# Altium project dtu.PrjPcb
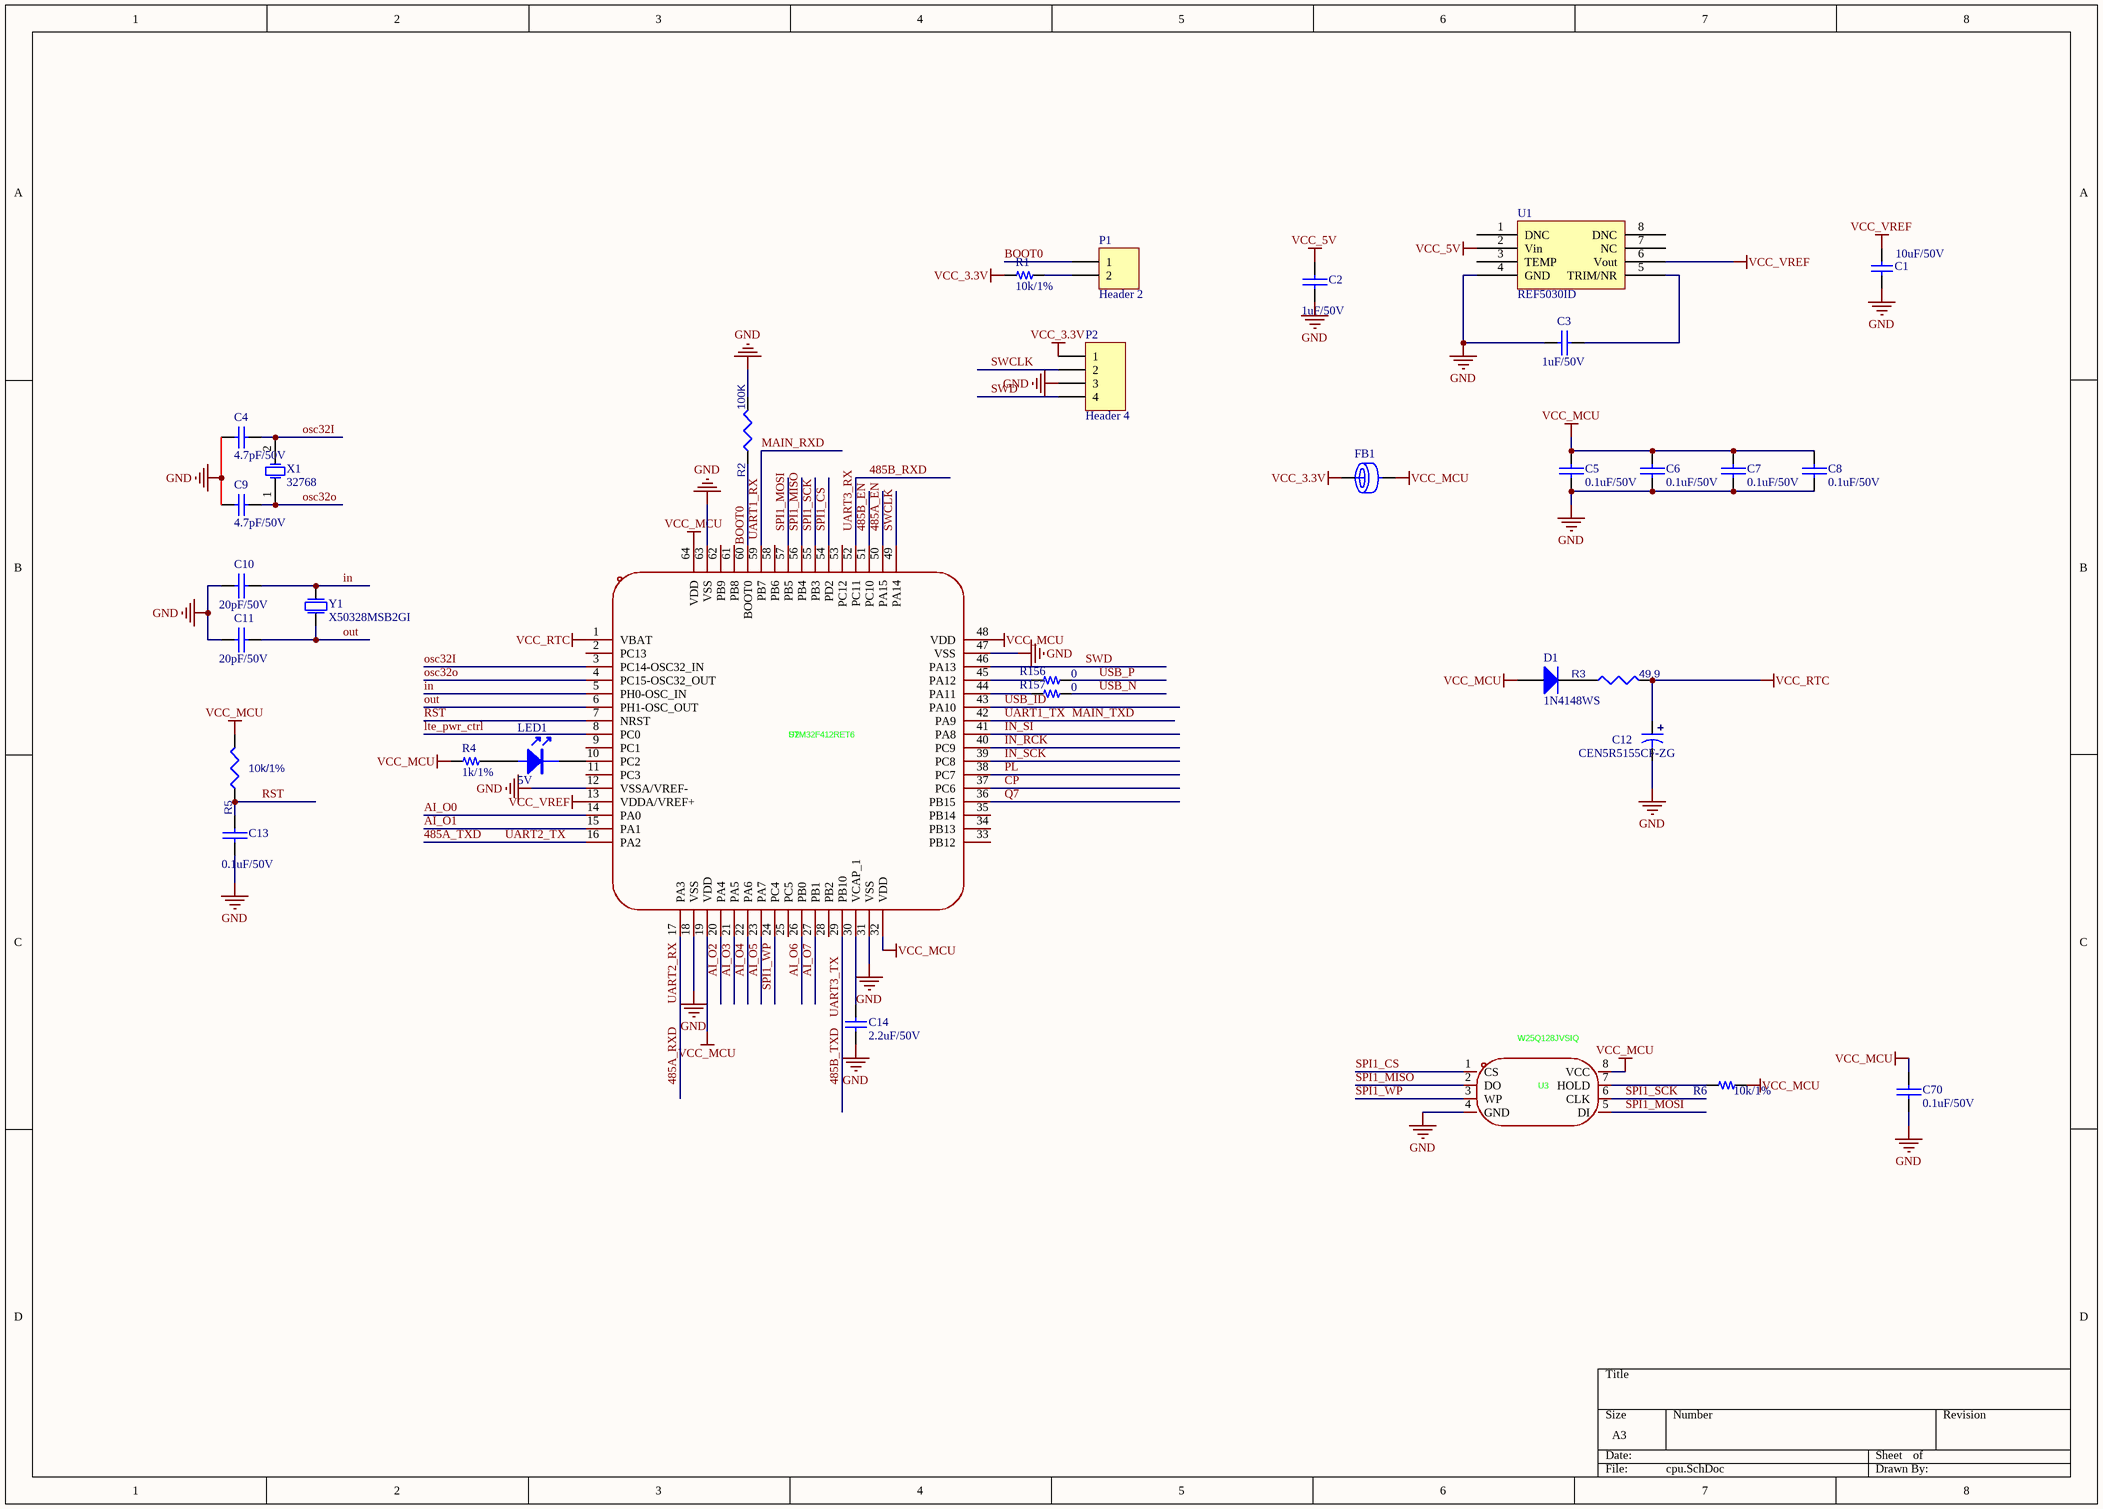
[diagram p0: cpu.SchDoc]
4 sheets, 186 parts. Net scope: global (net labels, ports and power ports of the same name join across sheets).
Board file: DTU_V1.0.PcbDoc
Sheets:
  cpu.SchDoc
  DI.SchDoc
  lte.SchDoc
  power.SchDoc

## Sheet cpu.SchDoc
size A3; SheetNumber: 1; SheetTotal: 7

### Parts
C1  10uF/50V  [CAPC2012X127N_0805]
C2  1uF/50V  [CAPC1608X092N_0603]
C3  1uF/50V  [CAPC1608X092N_0603]
C4  4.7pF/50V  [0603C]
C5  0.1uF/50V  [CAPC1608X092N_0603]
C6  0.1uF/50V  [CAPC1608X092N_0603]
C7  0.1uF/50V  [CAPC1608X092N_0603]
C8  0.1uF/50V  [CAPC1608X092N_0603]
C9  4.7pF/50V  [0603C]
C10  value 20pF/50V  [CAPC1608X092N_0603]  (hidden comment: 20pF/25V)
C11  value 20pF/50V  [CAPC1608X092N_0603]  (hidden comment: 20pF/25V)
C12  CEN5R5155CF-ZG  [CAP-TH_BD21.0-P5.00-D0.8_CENXXX-CF]
C13  0.1uF/50V  [CAPC1608X092N_0603]
C14  2.2uF/50V  [0603C]
C70  0.1uF/50V  [CAPC1608X092N_0603]
D1  1N4148WS  [SOD323]
FB1  FBC0603  [FBC0603]  (value not drawn)
LED1  5V  [0603LED]
P1  Header 2  [HDR1X2]
P2  Header 4  [HDR1X4]
R1  10k/1%  [RESC1608X055N_0603]
R2  100K  [0603R]
R3  49.9  [0603R]
R4  1k/1%  [RESC1608X055N_0603]
R5  10k/1%  [0603R]
R6  10k/1%  [RESC1608X055N_0603]
R156  0  [RESC1608X055N_0603]  (no BOM)
R157  0  [RESC1608X055N_0603]  (no BOM)
U1  REF5030ID  [SO-8]
U2  STM32F412RET6  [LQFP-64]
U3  W25Q128JVSIQ  [so-8]
X1  32768  [A]
Y1  X50328MSB2GI  [CRAY_5032]

### Nets
GND: C1.1 C2.1 C3.2 C4.2 C5.1 C6.1 C7.1 C8.1 C9.2 C10.2 C11.2 C12.2 C13.1 C14.2 C70.1 P2.3 R2.2 U1.4(GND) U2.12(VSSA/VREF-) U2.18(VSS) U2.31(VSS) U2.47(VSS) U2.63(VSS) U3.4(GND)
VCC_3.3V: FB1.1 P2.1 R1.1
VCC_5V: C2.2 U1.2(Vin)
VCC_MCU: C5.2 C6.2 C7.2 C8.2 C70.2 D1.1(A) FB1.2 R4.2 R5.2 R6.1 U2.19(VDD) U2.32(VDD) U2.48(VDD) U2.64(VDD) U3.8(VCC)
VCC_RTC: C12.1 R3.2 U2.1(VBAT)
VCC_VREF: C1.2 U1.6(Vout) U2.13(VDDA/VREF+)
485A_EN: U2.50(PA15)
485A_RXD: U2.17(PA3)  [also labelled UART2_RX]
485A_TXD: U2.16(PA2)  [also labelled UART2_TX]
485B_EN: U2.51(PC10)
485B_RXD: U2.52(PC11)  [also labelled UART3_RX]
485B_TXD: U2.29(PB10)  [also labelled UART3_TX]
AI_O0: U2.14(PA0)
AI_O1: U2.15(PA1)
AI_O2: U2.20(PA4)
AI_O3: U2.21(PA5)
AI_O4: U2.22(PA6)
AI_O5: U2.23(PA7)
AI_O6: U2.26(PB0)
AI_O7: U2.27(PB1)
BOOT0: P1.1 R2.1 U2.60(BOOT0)
CP: U2.37(PC6)
in: C10.1 U2.5(PH0-OSC_IN) Y1.1(P1)
IN_RCK: U2.40(PC9)
IN_SCK: U2.39(PC8)
IN_SI: U2.41(PA8)
lte_pwr_ctrl: U2.8(PC0)
MAIN_RXD: U2.59(PB7)  [also labelled UART1_RX]
MAIN_TXD: U2.42(PA9)  [also labelled UART1_TX]
osc32I: C4.1 U2.3(PC14-OSC32_IN) X1.2(OSC2)
osc32o: C9.1 U2.4(PC15-OSC32_OUT) X1.1(OSC1)
out: C11.1 U2.6(PH1-OSC_OUT) Y1.2(P2)
PL: U2.38(PC7)
Q7: U2.36(PB15)
RST: C13.2 R5.1 U2.7(NRST)
SPI1_CS: U2.54(PD2) U3.1(CS)
SPI1_MISO: U2.56(PB4) U3.2(DO)
SPI1_MOSI: U2.57(PB5) U3.5(DI)
SPI1_SCK: U2.55(PB3) U3.6(CLK)
SPI1_WP: U2.24(PC4) U3.3(WP)
SWCLK: P2.2 U2.49(PA14)
SWD: P2.4 U2.46(PA13)
USB_ID: U2.43(PA10)
USB_N: R157.1
USB_P: R156.1
NetC3_1: C3.1 U1.5(TRIM/NR)
NetC14_1: C14.1 U2.30(VCAP_1)
NetD1_2: D1.2(K) R3.1
NetLED1_1: LED1.1 R4.1
NetLED1_2: LED1.2 U2.10(PC2)
NetP1_2: P1.2 R1.2
NetR6_2: R6.2 U3.7(HOLD)
NetR156_2: R156.2 U2.45(PA12)
NetR157_2: R157.2 U2.44(PA11)

Not connected (* = marked no-connect by the designer): U1 1(DNC) 3(TEMP) 7(NC) 8(DNC); U2 2(PC13) 9(PC1) 11(PC3) 25(PC5) 28(PB2) 33(PB12) 34(PB13) 35(PB14) 53(PC12) 58(PB6) 61(PB8) 62(PB9)

### Library data of the parts
C1 = Cap: PartNumber: CL21A106KBYQNNE; Value: 10uF/50V; Package: 0805
C2 C3 C13 = CAP: PartNumber: CL10A105KB8NNNC; Package: 0603
  C2 C3: Value: 1uF/50V
  C13: Value: 0.1uF/50V
C4 = Cap: Capacitor; Value: 4.7pF
C5-C8 C70 = CAP: PartNumber: CC0603KRX7R9BB104; Value: 0.1uF/50V; Package: 0603
C9 C14 = Cap: Capacitor
  C14: Value: 2.2uF/50V
C10 C11 = CAP: PartNumber: CC0603JRNPO9BN200; Package: 0603
C12 = CAP2: 电解电容
D1 = DIODE
FB1 = FBC0603: PartNumber: BLM18AG601SN1D; Value: 600 Ohms @ 100MHz
LED1 = LED: Package: 0603
P1 = Header 2: Header, 2-Pin
P2 = Header 4: Header, 4-Pin
R1 R4 R6 R156 R157 = R: PartNumber: RC0603FR-071KL; Package: 0603
  R1 R6: Value: 10k/1%
  R4: Value: 1k/1%
  R156 R157: Value: 0
R2 R3 = RESISTOR_0
  R2: Value: 100K
  R3: Value: 49.9
R5 = RESISTOR_0: Value: 10K
U1 = REF5030: PartNumber: REF5030IDR; Value: REF5030ID
U3 = XL1509-5.0
X1 = XTAL: Crystal Oscillator
Y1 = XTAL: Value: X50328MSB2GI; PartNumber: X50328MSB2GI

## Sheet DI.SchDoc
size A2; SheetNumber: 4; SheetTotal: 7
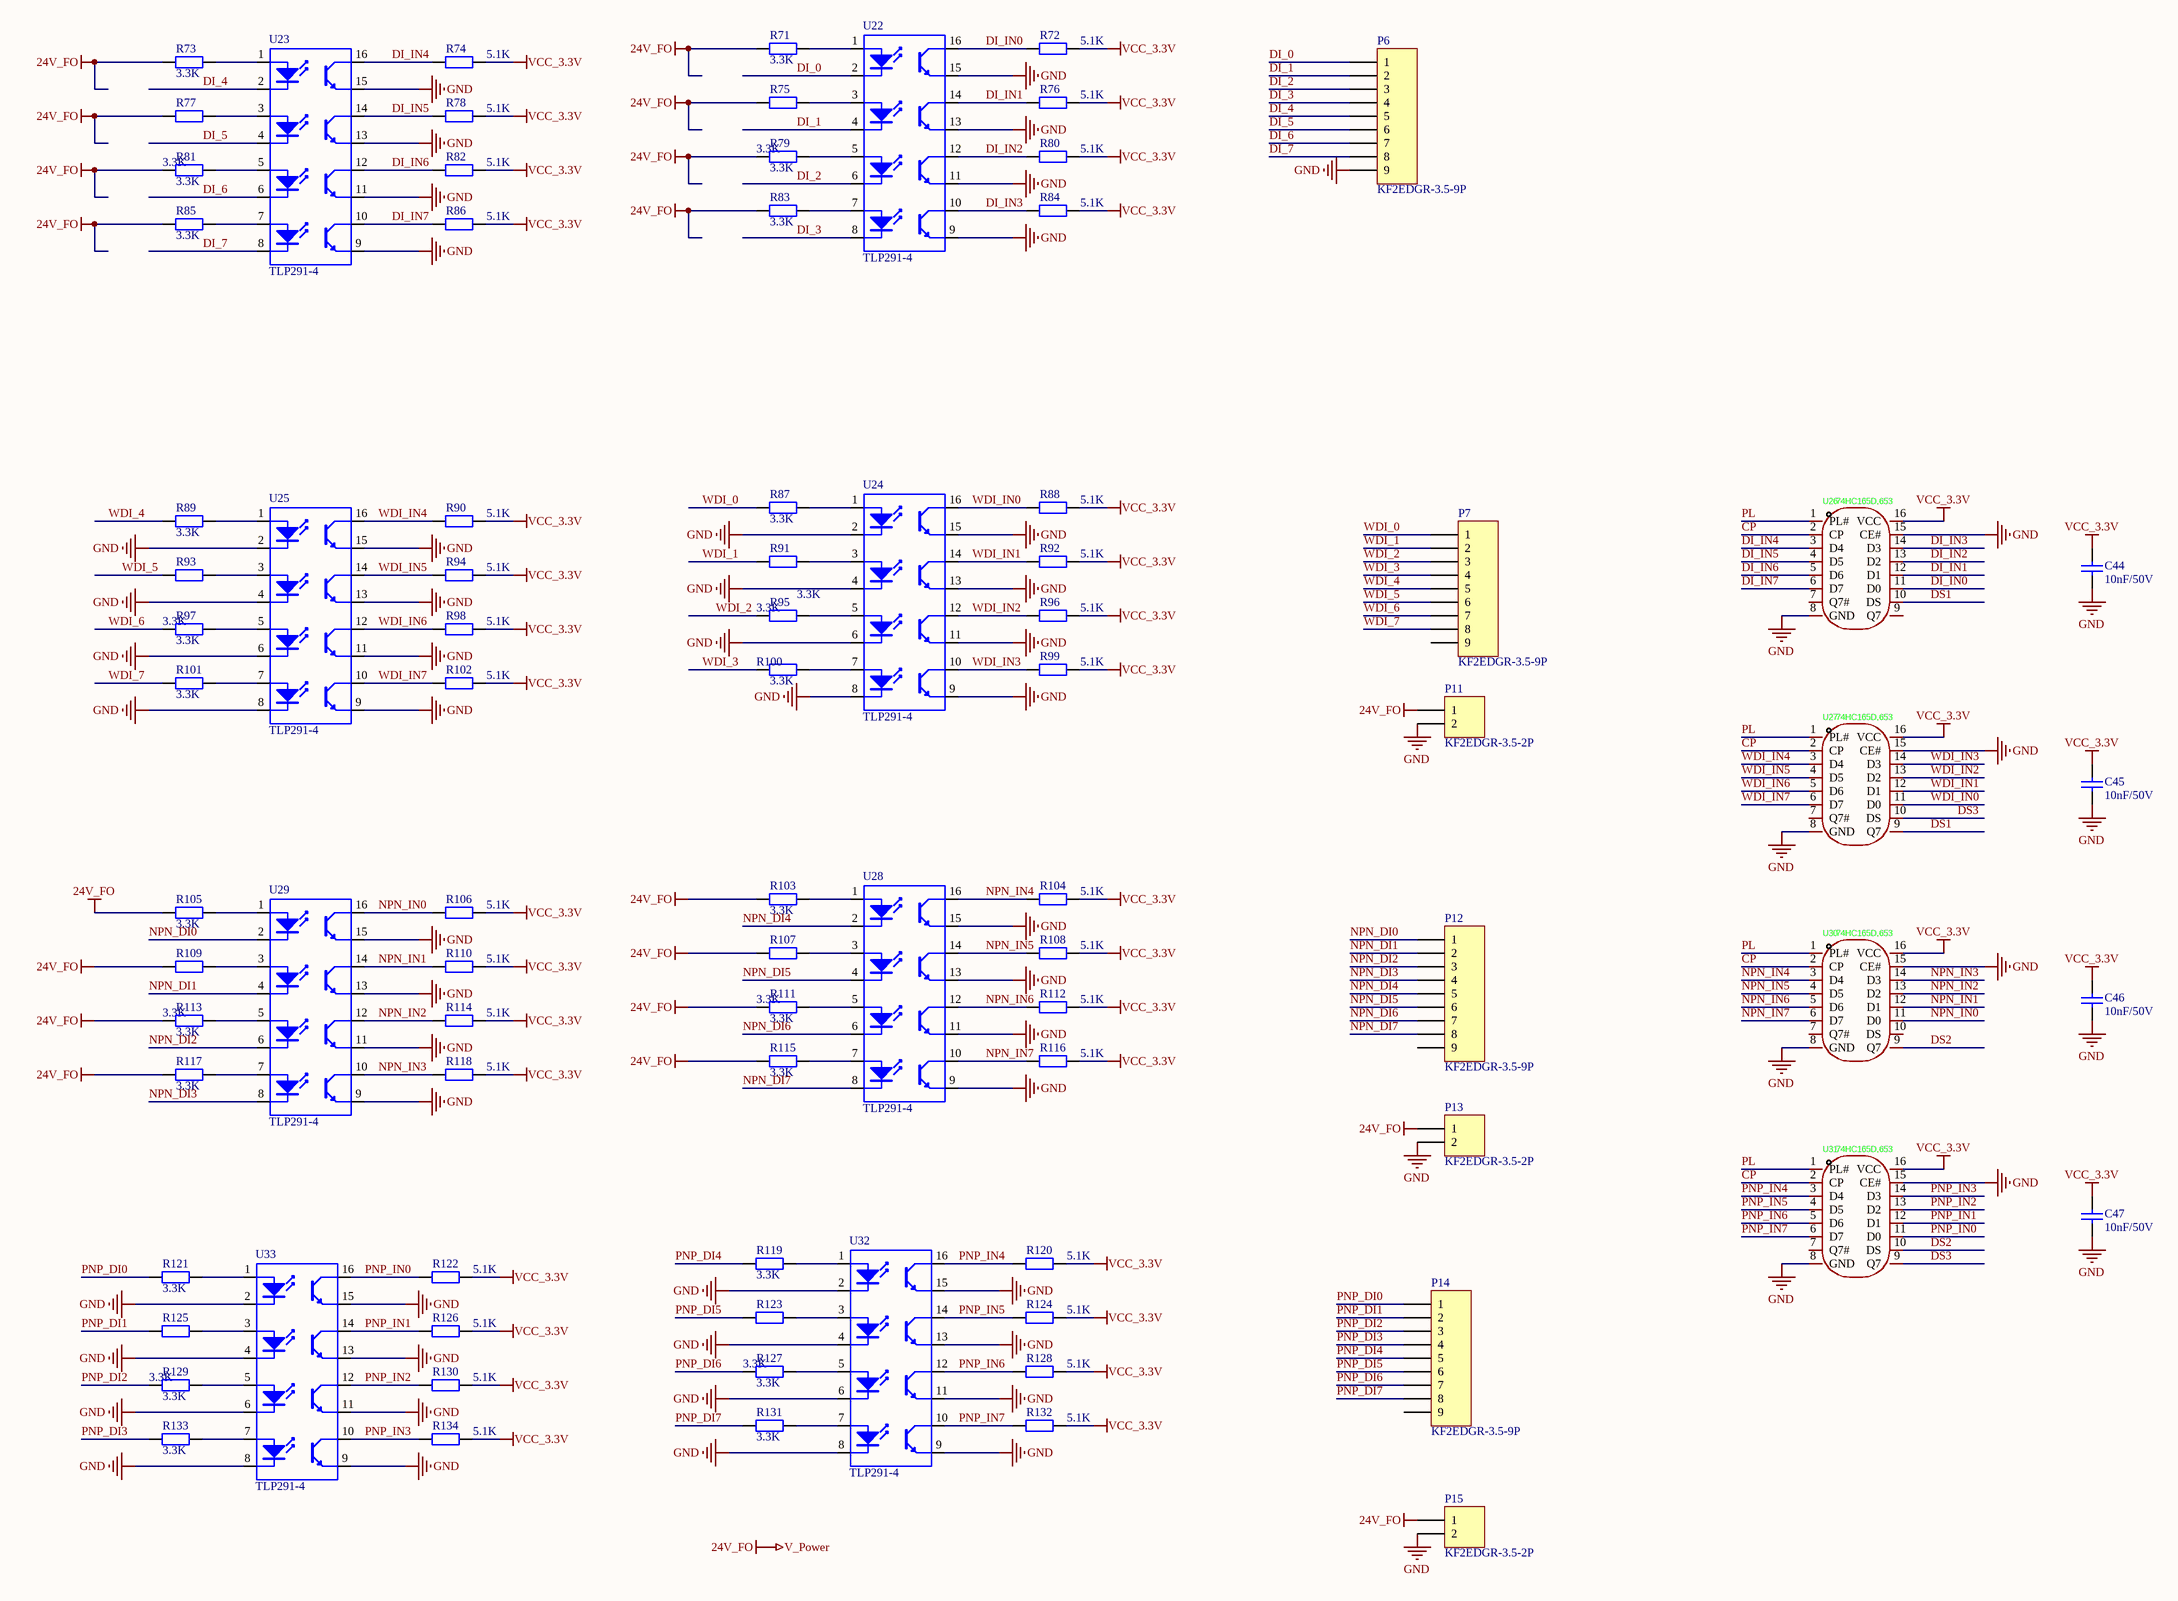
[diagram p1: DI.SchDoc]

### Parts
C44  10nF/50V  [0603C]
C45  10nF/50V  [0603C]
C46  10nF/50V  [0603C]
C47  10nF/50V  [0603C]
P6  KF2EDGR-3.5-9P  [CONN-TH_9P-P3.50_KF2EDGR-3.5-9P]
P7  KF2EDGR-3.5-9P  [CONN-TH_9P-P3.50_KF2EDGR-3.5-9P]
P11  KF2EDGR-3.5-2P  [CONN-TH_P3.50_KF2EDGR-3.5-2P]
P12  KF2EDGR-3.5-9P  [CONN-TH_9P-P3.50_KF2EDGR-3.5-9P]
P13  KF2EDGR-3.5-2P  [CONN-TH_P3.50_KF2EDGR-3.5-2P]
P14  KF2EDGR-3.5-9P  [CONN-TH_9P-P3.50_KF2EDGR-3.5-9P]
P15  KF2EDGR-3.5-2P  [CONN-TH_P3.50_KF2EDGR-3.5-2P]
R71  3.3K  [0603R]
R72  5.1K  [0603R]
R73  3.3K  [0603R]
R74  5.1K  [0603R]
R75  3.3K  [0603R]
R76  5.1K  [0603R]
R77  3.3K  [0603R]
R78  5.1K  [0603R]
R79  3.3K  [0603R]
R80  5.1K  [0603R]
R81  3.3K  [0603R]
R82  5.1K  [0603R]
R83  3.3K  [0603R]
R84  5.1K  [0603R]
R85  3.3K  [0603R]
R86  5.1K  [0603R]
R87  3.3K  [0603R]
R88  5.1K  [0603R]
R89  3.3K  [0603R]
R90  5.1K  [0603R]
R91  3.3K  [0603R]
R92  5.1K  [0603R]
R93  3.3K  [0603R]
R94  5.1K  [0603R]
R95  3.3K  [0603R]
R96  5.1K  [0603R]
R97  3.3K  [0603R]
R98  5.1K  [0603R]
R99  5.1K  [0603R]
R100  3.3K  [0603R]
R101  3.3K  [0603R]
R102  5.1K  [0603R]
R103  3.3K  [0603R]
R104  5.1K  [0603R]
R105  3.3K  [0603R]
R106  5.1K  [0603R]
R107  3.3K  [0603R]
R108  5.1K  [0603R]
R109  3.3K  [0603R]
R110  5.1K  [0603R]
R111  3.3K  [0603R]
R112  5.1K  [0603R]
R113  3.3K  [0603R]
R114  5.1K  [0603R]
R115  3.3K  [0603R]
R116  5.1K  [0603R]
R117  3.3K  [0603R]
R118  5.1K  [0603R]
R119  3.3K  [0603R]
R120  5.1K  [0603R]
R121  3.3K  [0603R]
R122  5.1K  [0603R]
R123  3.3K  [0603R]
R124  5.1K  [0603R]
R125  3.3K  [0603R]
R126  5.1K  [0603R]
R127  3.3K  [0603R]
R128  5.1K  [0603R]
R129  3.3K  [0603R]
R130  5.1K  [0603R]
R131  3.3K  [0603R]
R132  5.1K  [0603R]
R133  3.3K  [0603R]
R134  5.1K  [0603R]
U22  TLP291-4  [SOP16-T]
U23  TLP291-4  [SOP16-T]
U24  TLP291-4  [SOP16-T]
U25  TLP291-4  [SOP16-T]
U26  74HC165D,653  [SOP-16_L10.0-W3.9-P1.27-LS6.0-BL]
U27  74HC165D,653  [SOP-16_L10.0-W3.9-P1.27-LS6.0-BL]
U28  TLP291-4  [SOP16-T]
U29  TLP291-4  [SOP16-T]
U30  74HC165D,653  [SOP-16_L10.0-W3.9-P1.27-LS6.0-BL]
U31  74HC165D,653  [SOP-16_L10.0-W3.9-P1.27-LS6.0-BL]
U32  TLP291-4  [SOP16-T]
U33  TLP291-4  [SOP16-T]

### Nets
24V_FO: P11.1 P13.1 P15.1 R71.2 R73.2 R75.2 R77.2 R79.2 R81.2 R83.2 R85.2 R103.2 R105.2 R107.2 R109.2 R111.2 R113.2 R115.2 R117.2  [also labelled V_Power]
GND: C44.1 C45.1 C46.1 C47.1 P6.9 P11.2 P13.2 P15.2 U22.9(E) U22.11(E) U22.13(E) U22.15(E) U23.9(E) U23.11(E) U23.13(E) U23.15(E) U24.2(K) U24.4(K) U24.6(K) U24.8(K) U24.9(E) U24.11(E) U24.13(E) U24.15(E) U25.2(K) U25.4(K) U25.6(K) U25.8(K) U25.9(E) U25.11(E) U25.13(E) U25.15(E) U26.8(GND) U26.15(CE#) U27.8(GND) U27.15(CE#) U28.9(E) U28.11(E) U28.13(E) U28.15(E) U29.9(E) U29.11(E) U29.13(E) U29.15(E) U30.8(GND) U30.15(CE#) U31.8(GND) U31.15(CE#) U32.2(K) U32.4(K) U32.6(K) U32.8(K) U32.9(E) U32.11(E) U32.13(E) U32.15(E) U33.2(K) U33.4(K) U33.6(K) U33.8(K) U33.9(E) U33.11(E) U33.13(E) U33.15(E)
VCC_3.3V: C44.2 C45.2 C46.2 C47.2 R72.1 R74.1 R76.1 R78.1 R80.1 R82.1 R84.1 R86.1 R88.1 R90.1 R92.1 R94.1 R96.1 R98.1 R99.1 R102.1 R104.1 R106.1 R108.1 R110.1 R112.1 R114.1 R116.1 R118.1 R120.1 R122.1 R124.1 R126.1 R128.1 R130.1 R132.1 R134.1 U26.16(VCC) U27.16(VCC) U30.16(VCC) U31.16(VCC)
CP: U26.2(CP) U27.2(CP) U30.2(CP) U31.2(CP)
DI_0: P6.1 U22.2(K)
DI_1: P6.2 U22.4(K)
DI_2: P6.3 U22.6(K)
DI_3: P6.4 U22.8(K)
DI_4: P6.5 U23.2(K)
DI_5: P6.6 U23.4(K)
DI_6: P6.7 U23.6(K)
DI_7: P6.8 U23.8(K)
DI_IN0: R72.2 U22.16(C) U26.11(D0)
DI_IN1: R76.2 U22.14(C) U26.12(D1)
DI_IN2: R80.2 U22.12(C) U26.13(D2)
DI_IN3: R84.2 U22.10(C) U26.14(D3)
DI_IN4: R74.2 U23.16(C) U26.3(D4)
DI_IN5: R78.2 U23.14(C) U26.4(D5)
DI_IN6: R82.2 U23.12(C) U26.5(D6)
DI_IN7: R86.2 U23.10(C) U26.6(D7)
DS1: U26.10(DS) U27.9(Q7)
DS2: U30.9(Q7) U31.10(DS)
DS3: U27.10(DS) U31.9(Q7)
NPN_DI0: P12.1 U29.2(K)
NPN_DI1: P12.2 U29.4(K)
NPN_DI2: P12.3 U29.6(K)
NPN_DI3: P12.4 U29.8(K)
NPN_DI4: P12.5 U28.2(K)
NPN_DI5: P12.6 U28.4(K)
NPN_DI6: P12.7 U28.6(K)
NPN_DI7: P12.8 U28.8(K)
NPN_IN0: R106.2 U29.16(C) U30.11(D0)
NPN_IN1: R110.2 U29.14(C) U30.12(D1)
NPN_IN2: R114.2 U29.12(C) U30.13(D2)
NPN_IN3: R118.2 U29.10(C) U30.14(D3)
NPN_IN4: R104.2 U28.16(C) U30.3(D4)
NPN_IN5: R108.2 U28.14(C) U30.4(D5)
NPN_IN6: R112.2 U28.12(C) U30.5(D6)
NPN_IN7: R116.2 U28.10(C) U30.6(D7)
PL: U26.1(PL#) U27.1(PL#) U30.1(PL#) U31.1(PL#)
PNP_DI0: P14.1 R121.2
PNP_DI1: P14.2 R125.2
PNP_DI2: P14.3 R129.2
PNP_DI3: P14.4 R133.2
PNP_DI4: P14.5 R119.2
PNP_DI5: P14.6 R123.2
PNP_DI6: P14.7 R127.2
PNP_DI7: P14.8 R131.2
PNP_IN0: R122.2 U31.11(D0) U33.16(C)
PNP_IN1: R126.2 U31.12(D1) U33.14(C)
PNP_IN2: R130.2 U31.13(D2) U33.12(C)
PNP_IN3: R134.2 U31.14(D3) U33.10(C)
PNP_IN4: R120.2 U31.3(D4) U32.16(C)
PNP_IN5: R124.2 U31.4(D5) U32.14(C)
PNP_IN6: R128.2 U31.5(D6) U32.12(C)
PNP_IN7: R132.2 U31.6(D7) U32.10(C)
WDI_0: P7.1 R87.2
WDI_1: P7.2 R91.2
WDI_2: P7.3 R95.2
WDI_3: P7.4 R100.2
WDI_4: P7.5 R89.2
WDI_5: P7.6 R93.2
WDI_6: P7.7 R97.2
WDI_7: P7.8 R101.2
WDI_IN0: R88.2 U24.16(C) U27.11(D0)
WDI_IN1: R92.2 U24.14(C) U27.12(D1)
WDI_IN2: R96.2 U24.12(C) U27.13(D2)
WDI_IN3: R99.2 U24.10(C) U27.14(D3)
WDI_IN4: R90.2 U25.16(C) U27.3(D4)
WDI_IN5: R94.2 U25.14(C) U27.4(D5)
WDI_IN6: R98.2 U25.12(C) U27.5(D6)
WDI_IN7: R102.2 U25.10(C) U27.6(D7)
NetR71_1: R71.1 U22.1(A)
NetR73_1: R73.1 U23.1(A)
NetR75_1: R75.1 U22.3(A)
NetR77_1: R77.1 U23.3(A)
NetR79_1: R79.1 U22.5(A)
NetR81_1: R81.1 U23.5(A)
NetR83_1: R83.1 U22.7(A)
NetR85_1: R85.1 U23.7(A)
NetR87_1: R87.1 U24.1(A)
NetR89_1: R89.1 U25.1(A)
NetR91_1: R91.1 U24.3(A)
NetR93_1: R93.1 U25.3(A)
NetR95_1: R95.1 U24.5(A)
NetR97_1: R97.1 U25.5(A)
NetR100_1: R100.1 U24.7(A)
NetR101_1: R101.1 U25.7(A)
NetR103_1: R103.1 U28.1(A)
NetR105_1: R105.1 U29.1(A)
NetR107_1: R107.1 U28.3(A)
NetR109_1: R109.1 U29.3(A)
NetR111_1: R111.1 U28.5(A)
NetR113_1: R113.1 U29.5(A)
NetR115_1: R115.1 U28.7(A)
NetR117_1: R117.1 U29.7(A)
NetR119_1: R119.1 U32.1(A)
NetR121_1: R121.1 U33.1(A)
NetR123_1: R123.1 U32.3(A)
NetR125_1: R125.1 U33.3(A)
NetR127_1: R127.1 U32.5(A)
NetR129_1: R129.1 U33.5(A)
NetR131_1: R131.1 U32.7(A)
NetR133_1: R133.1 U33.7(A)

Not connected (* = marked no-connect by the designer): P7 9; P12 9; P14 9; U26 7(Q7#) 9(Q7); U27 7(Q7#); U30 7(Q7#) 10(DS); U31 7(Q7#)

### Library data of the parts
C44-C47 = Cap: Capacitor; Value: 10nF/50V
P6 P7 P12 P14 = Header 9: Header, 9-Pin
P11 P13 P15 = Header 2: Header, 2-Pin
R71-R134 = Res0805M
U22-U25 U28 U29 U32 U33 = TLP281-4

## Sheet lte.SchDoc
size A3; SheetNumber: 5; SheetTotal: 7
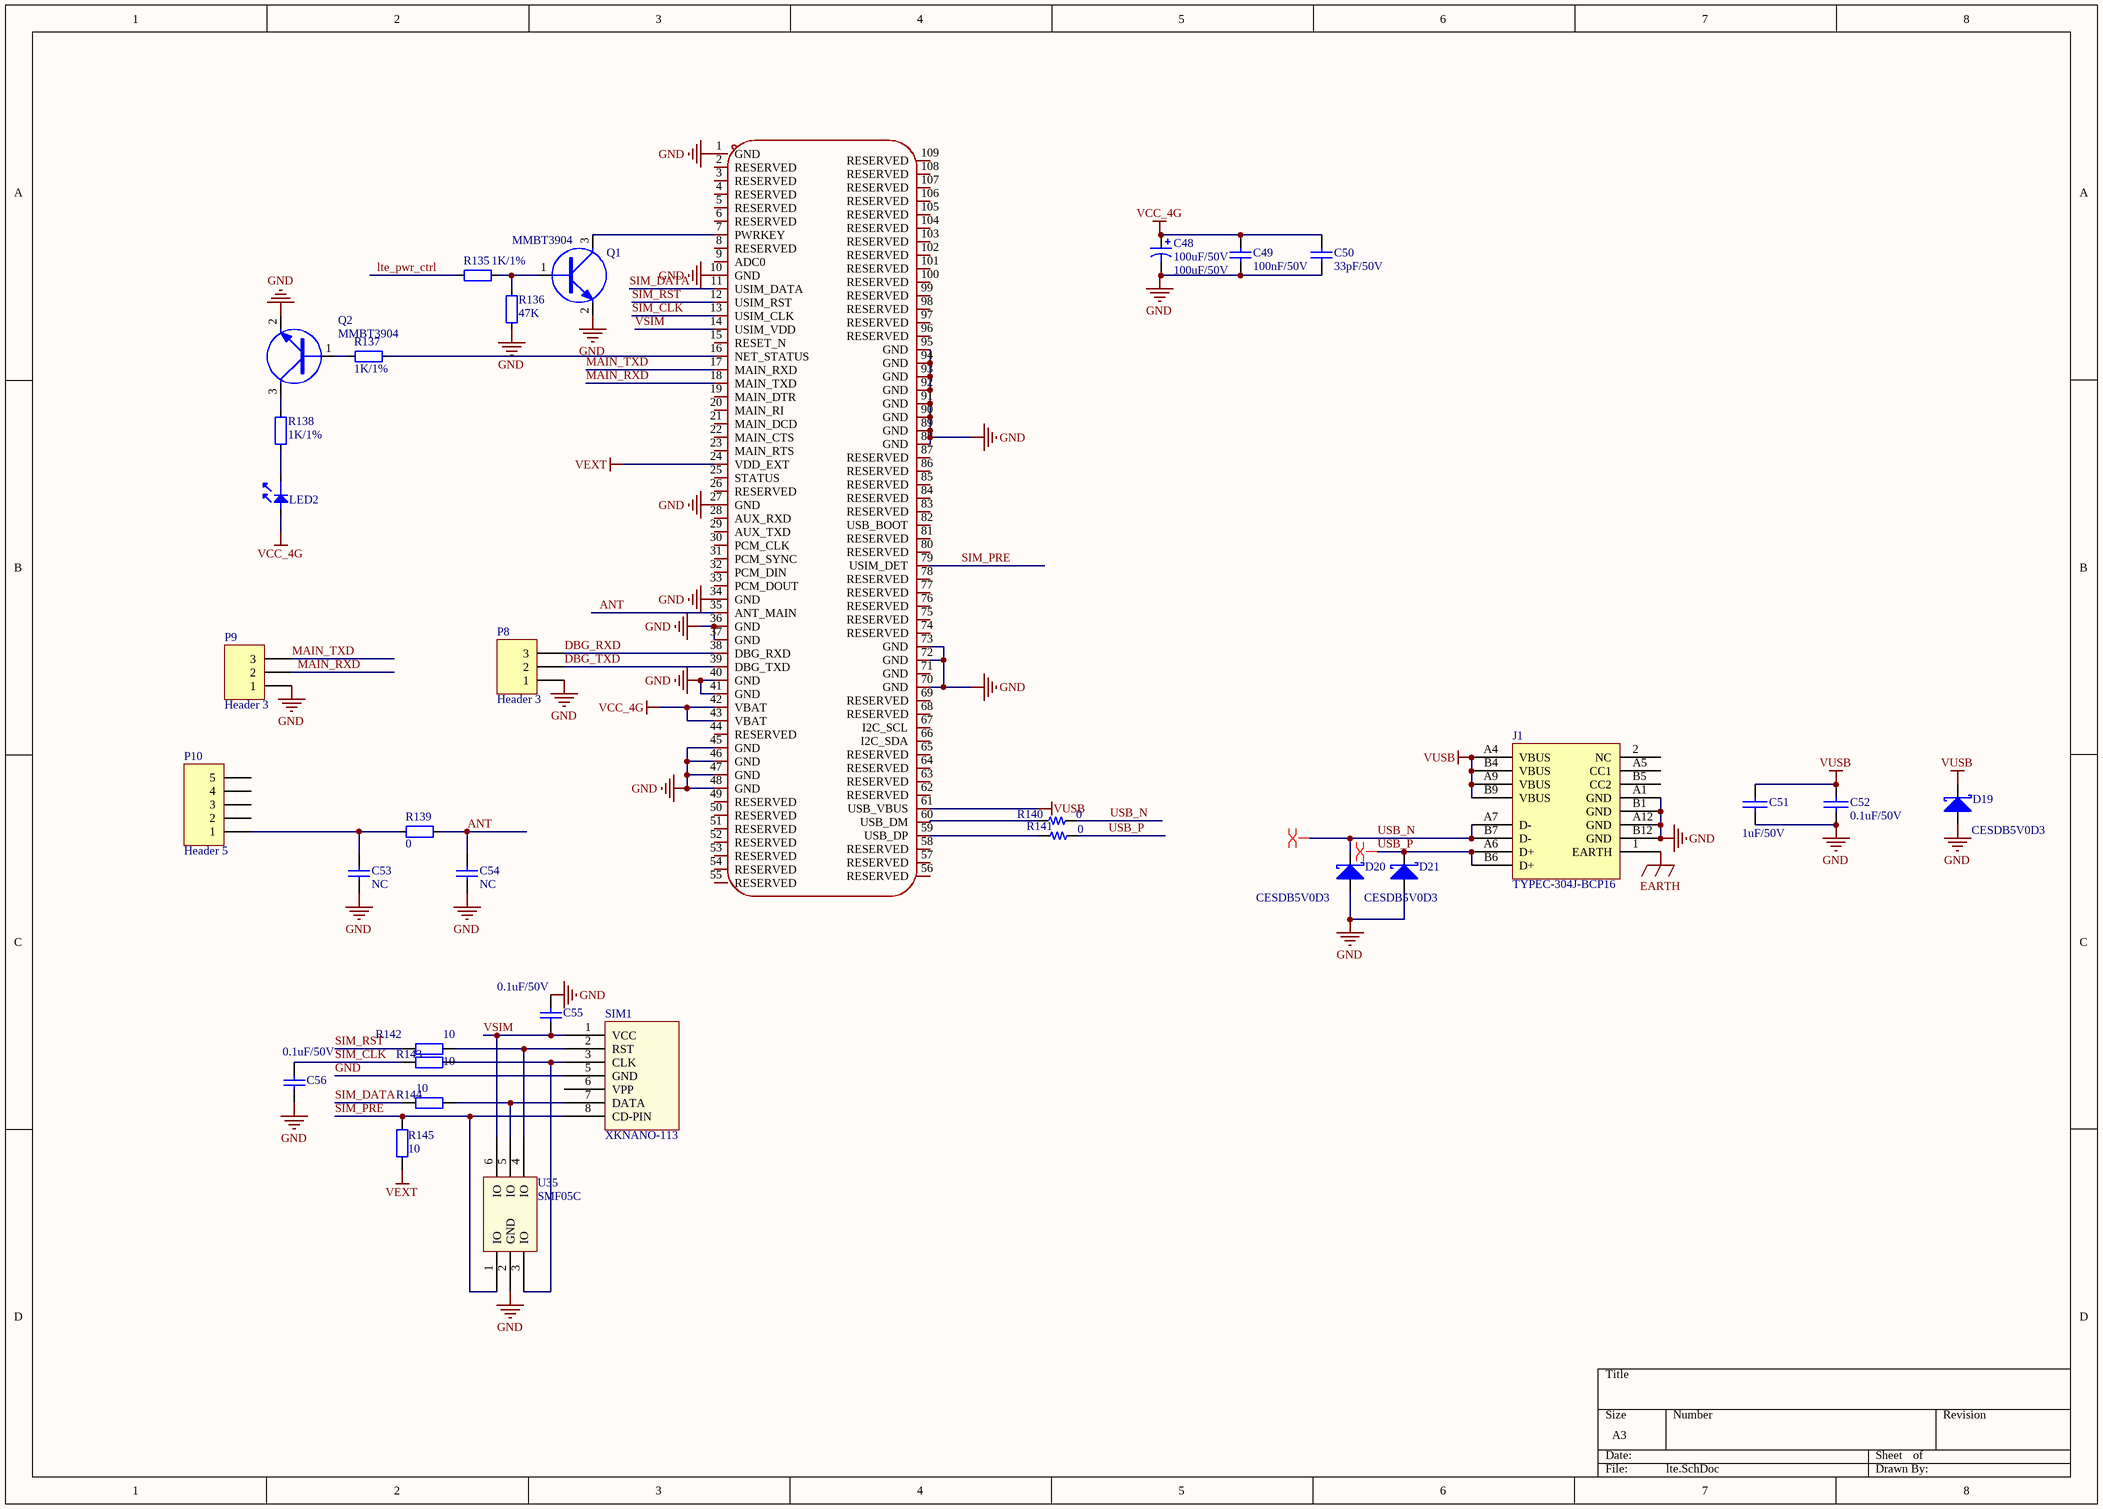
[diagram p2: lte.SchDoc]

### Parts
C48  100uF/50V  [CAP-SMD_BD6.3-L6.5-W6.5-LS7.0-FD]
C49  100nF/50V  [0603C]
C50  33pF/50V  [0603C]
C51  1uF/50V  [CAPC1608X092N_0603]
C52  0.1uF/50V  [CAPC1608X092N_0603]
C53  NC  [0603c]  (no BOM)
C54  NC  [0603c]  (no BOM)
C55  0.1uF/50V  [0603c]
C56  0.1uF/50V  [0603c]  (no BOM)
D19  CESDB5V0D3  [SOD323]
D20  CESDB5V0D3  [SOD323]
D21  CESDB5V0D3  [SOD323]
J1  TYPEC-304J-BCP16  [TYPEC_16P]
LED2  LED_Green_19-217  [0603led]  (value not drawn)
P8  Header 3  [HDR1X3]
P9  Header 3  [HDR1X3]
P10  Header 5  [KH-SMA-KE-Z]
Q1  MMBT3904  [SOT23-3]
Q2  MMBT3904  [SOT23-3]
R135  1K/1%  [0603R]
R136  47K  [0603r]
R137  1K/1%  [0603r]
R138  1K/1%  [0603R]
R139  0  [0603r]
R140  0  [RESC1608X055N_0603]  (no BOM)
R141  0  [RESC1608X055N_0603]  (no BOM)
R142  10  [0603r]
R143  10  [0603r]
R144  10  [0603r]
R145  10  [0603r]
SIM1  XKNANO-113  [Nano SIM]
U34  EC800ECNNQ-N03-SNNSA  [LCC-LGA-109_L17.7-W15.8-P1.10_MC661]  (value not drawn)
U35  SMF05C  [sc70-6l]

### Nets
EARTH: J1.1(EARTH)
GND: C48.2 C49.1 C50.1 C51.1 C52.1 C53.2 C54.2 C55.1 C56.2 D19.1(A) D20.1(A) D21.1(A) J1.A1(GND) J1.A12(GND) J1.B1(GND) J1.B12(GND) P8.1 P9.1 Q1.2(E) Q2.2(E) R136.1 SIM1.5(GND) U34.1(GND) U34.10(GND) U34.27(GND) U34.34(GND) U34.36(GND) U34.37(GND) U34.40(GND) U34.41(GND) U34.45(GND) U34.46(GND) U34.47(GND) U34.48(GND) U34.70(GND) U34.72(GND) U34.73(GND) U34.88(GND) U34.89(GND) U34.90(GND) U34.91(GND) U34.92(GND) U34.93(GND) U34.94(GND) U34.95(GND) U35.2(GND)
VCC_4G: C48.1 C49.2 C50.2 LED2.1 U34.42(VBAT) U34.43(VBAT)
VEXT: R145.2 U34.24(VDD_EXT)
VUSB: C51.2 C52.2 D19.2(K) J1.A4(VBUS) J1.A9(VBUS) J1.B4(VBUS) J1.B9(VBUS) U34.61(USB_VBUS)
ANT: C54.1 R139.1 U34.35(ANT_MAIN)
DBG_RXD: P8.3 U34.38(DBG_RXD)
DBG_TXD: P8.2 U34.39(DBG_TXD)
lte_pwr_ctrl: R135.1
MAIN_RXD: P9.2 U34.18(MAIN_TXD)
MAIN_TXD: P9.3 U34.17(MAIN_RXD)
SIM_CLK: C56.1 R143.2 U34.13(USIM_CLK)
SIM_DATA: R144.2 U34.11(USIM_DATA)
SIM_PRE: R145.1 SIM1.8(CD-PIN) U34.79(USIM_DET) U35.1(IO)
SIM_RST: R142.2 U34.12(USIM_RST)
USB_N: D20.2(K) J1.A7(D-) J1.B7(D-) R140.1
USB_P: D21.2(K) J1.A6(D+) J1.B6(D+) R141.1
VSIM: C55.2 SIM1.1(VCC) U34.14(USIM_VDD) U35.6(IO)
NetC53_1: C53.1 P10.1 R139.2
NetLED2_2: LED2.2 R138.1
NetQ1_1: Q1.1(B) R135.2 R136.2
NetQ1_3: Q1.3(C) U34.7(PWRKEY)
NetQ2_1: Q2.1(B) R137.2
NetQ2_3: Q2.3(C) R138.2
NetR137_1: R137.1 U34.16(NET_STATUS)
NetR140_2: R140.2 U34.60(USB_DM)
NetR141_2: R141.2 U34.59(USB_DP)
NetR142_1: R142.1 SIM1.2(RST) U35.4(IO)
NetR143_1: R143.1 SIM1.3(CLK) U35.3(IO)
NetR144_1: R144.1 SIM1.7(DATA) U35.5(IO)

Not connected (* = marked no-connect by the designer): J1 2(NC) A5(CC1) B5(CC2); P10 2 3 4 5; SIM1 6(VPP); U34 2(RESERVED) 3(RESERVED) 4(RESERVED) 5(RESERVED) 6(RESERVED) 8(RESERVED) 9(ADC0) 15(RESET_N) 19(MAIN_DTR) 20(MAIN_RI) 21(MAIN_DCD) 22(MAIN_CTS) 23(MAIN_RTS) 25(STATUS) 26(RESERVED) 28(AUX_RXD) 29(AUX_TXD) 30(PCM_CLK) 31(PCM_SYNC) 32(PCM_DIN) 33(PCM_DOUT) 44(RESERVED) 49(RESERVED) 50(RESERVED) 51(RESERVED) 52(RESERVED) 53(RESERVED) 54(RESERVED) 55(RESERVED) 56(RESERVED) 57(RESERVED) 58(RESERVED) 62(RESERVED) 63(RESERVED) 64(RESERVED) 65(RESERVED) 66(I2C_SDA) 67(I2C_SCL) 68(RESERVED) 69(RESERVED) 71(GND) 74(RESERVED) 75(RESERVED) 76(RESERVED) 77(RESERVED) 78(RESERVED) 80(RESERVED) 81(RESERVED) 82(USB_BOOT) 83(RESERVED) 84(RESERVED) 85(RESERVED) 86(RESERVED) 87(RESERVED) 96(RESERVED) 97(RESERVED) 98(RESERVED) 99(RESERVED) 100(RESERVED) 101(RESERVED) 102(RESERVED) 103(RESERVED) 104(RESERVED) 105(RESERVED) 106(RESERVED) 107(RESERVED) 108(RESERVED) 109(RESERVED)

### Layout directives
differential pair: USB_N, USB_P

### Library data of the parts
C48 = Cap Pol3: Polarized Capacitor (Surface Mount); Value: 100uF/50V
C49 C50 C53 C54 = Cap: Capacitor
  C49: Value: 100nF/50V
  C50: Value: 33pF/50V
  C53 C54: Value: NC
C51 = CAP: PartNumber: CL10A105KB8NNNC; Value: 1uF/50V; Package: 0603
C52 = CAP: PartNumber: CC0603KRX7R9BB104; Value: 0.1uF/50V; Package: 0603
C55 C56 = Cap: Capacitor; Value: 0.1uF/10V
D19-D21 = DIODE S: PartNumber: CESDB5V0D3
  D21: Value: CESDB5V0D3
J1 = TYPE C_16P: Value: TYPEC-304J-BCP16; PartNumber: TYPEC-304J-BCP16
LED2 = LED_Green_19-217: 物料主编码(PN): 100000032; Value: 19-217/G7C-AN1P2/3T; 序号: 33; 物料名称: 绿色LED; 物料描述: Other,LED,绿色,0603,1.6X0.8X0.4mm,19-217/G7C-AN1P2/3T; 工作温度: –40°C to 85°C; 制造商: Everlight; 器件等级: ——; 物料类型: 特殊二极管; 规格型号(完整型号): 19-217/G7C-AN1P2/3T
P8 P9 = Header 3: Header, 3-Pin
P10 = Header 5: Header, 5-Pin
Q1 Q2 = NPN_MMBT3904
R135-R138 = RES0603: 物料主编码(PN): 150000040; Value: 1K; 序号: 109; 物料名称: 贴片电阻; 精度: ±1%; 规格型号(完整型号): RC1608F103CS/RC0603FR-0710KL; 物料描述: RES,贴片电阻,0603,10k,±1%,1/10W,1.6X0.8X0.45mm,RC1608F103CS/RC0603FR-0710KL; 工作温度: –55°C to 155°C; 制造商: 三星/YAGEO; 器件等级: ——; 物料类型: 表贴电阻; 参数值: 1.00E+04
R139 = RES0603: 物料主编码(PN): 150000040; 序号: 109; 物料名称: 贴片电阻; 精度: ±1%; 规格型号(完整型号): RC1608F103CS/RC0603FR-0710KL; 物料描述: RES,贴片电阻,0603,10k,±1%,1/10W,1.6X0.8X0.45mm,RC1608F103CS/RC0603FR-0710KL; 工作温度: –55°C to 155°C; 制造商: 三星/YAGEO; 器件等级: ——; 物料类型: 表贴电阻; 参数值: 1.00E+04; Value: 0
R140 R141 = R: PartNumber: RC0603FR-071KL; Value: 0; Package: 0603
R142-R145 = Res2: Resistor; Value: 10R
SIM1 = nano sim

## Sheet power.SchDoc
size A4; SheetNumber: 6; SheetTotal: 7
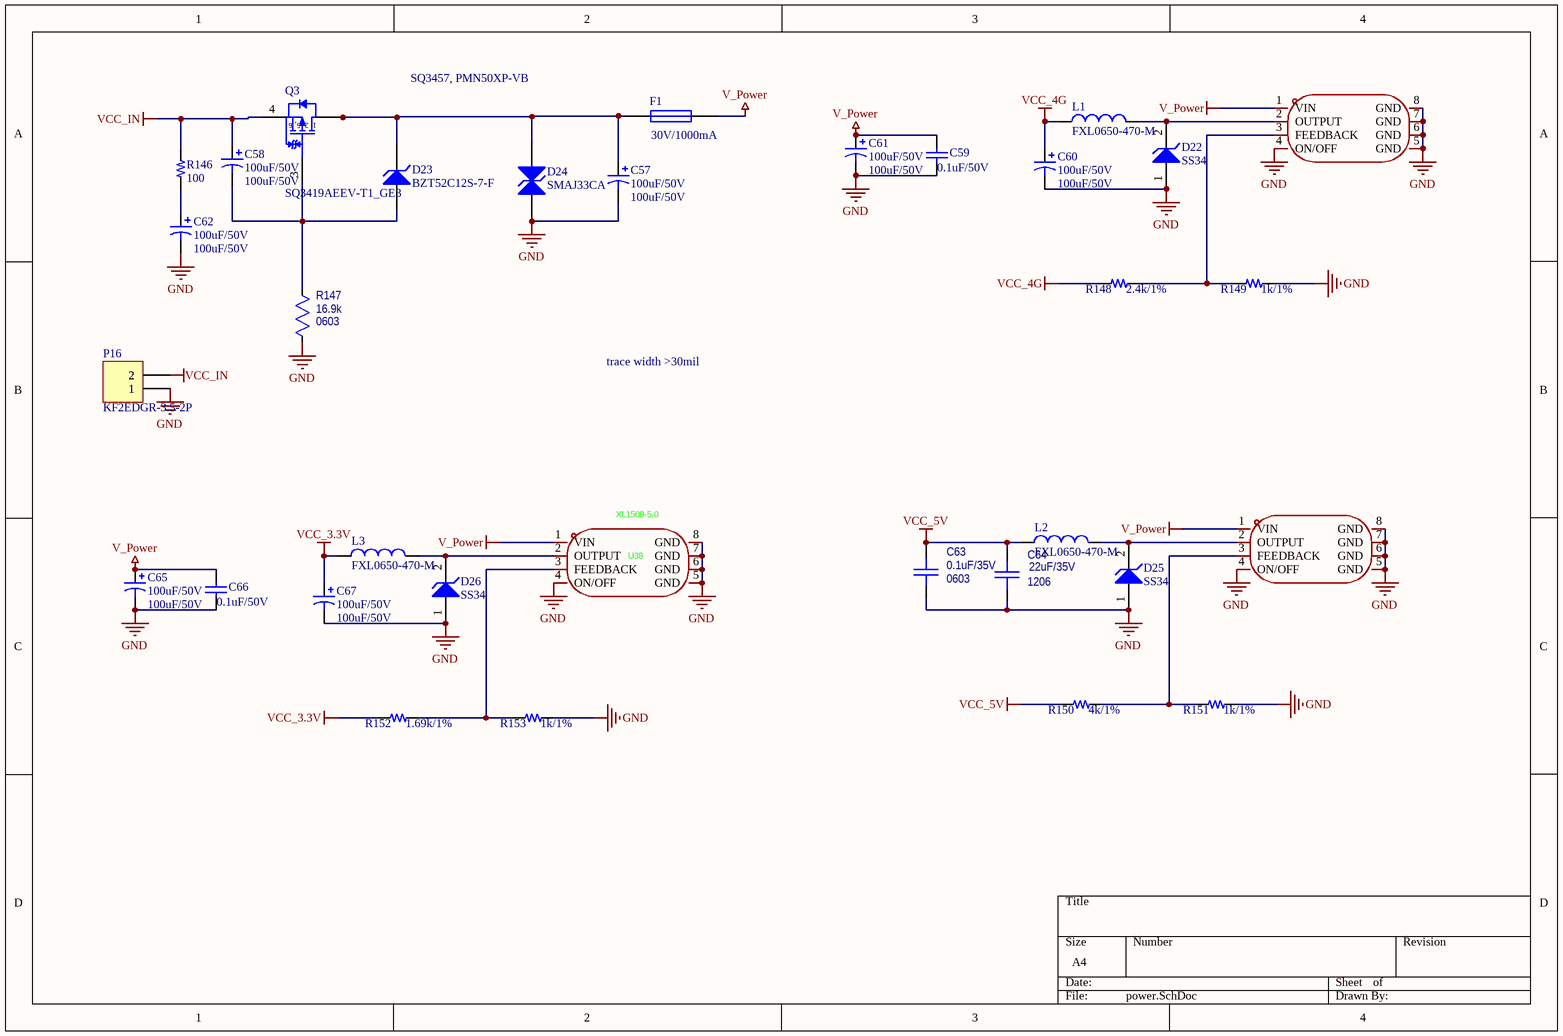
[diagram p3: power.SchDoc]

### Parts
C57  100uF/50V  [CAP-SMD_BD6.3-L6.5-W6.5-LS7.0-FD]
C58  100uF/50V  [CAP-SMD_BD6.3-L6.5-W6.5-LS7.0-FD]
C59  0.1uF/50V  [0603C]
C60  100uF/50V  [CAP-SMD_BD6.3-L6.5-W6.5-LS7.0-FD]
C61  100uF/50V  [CAP-SMD_BD6.3-L6.5-W6.5-LS7.0-FD]
C62  100uF/50V  [CAP-SMD_BD6.3-L6.5-W6.5-LS7.0-FD]
C63  Package: 0603  [CAPC3216X156N_1206]  (hidden comment: 0.1uF/35V)
C64  Package: 1206  [CAPC3216X156N_1206]  (hidden comment: 22uF/35V)
C65  100uF/50V  [CAP-SMD_BD6.3-L6.5-W6.5-LS7.0-FD]
C66  0.1uF/50V  [0603C]
C67  100uF/50V  [CAP-SMD_BD6.3-L6.5-W6.5-LS7.0-FD]
D22  SS34  [SMA]
D23  BZT52C12S-7-F  [DIOD-SOD323-2_V]
D24  SMAJ33CA  [LFUS-DO-214AC-A-2_N]
D25  SS34  [SMA]
D26  SS34  [SMA]
F1  30V/1000mA  [RESC3216X070N_1206]
L1  FXL0650-470-M  [PULS-BDCD00252012_V]
L2  FXL0650-470-M  [PULS-BDCD00252012_V]
L3  FXL0650-470-M  [PULS-BDCD00252012_V]
P16  KF2EDGR-3.5-2P  [CONN-TH_P3.50_KF2EDGR-3.5-2P]
Q3  SQ3419AEEV-T1_GE3  [VISH-TSOP-6_V]
R146  100  [RESC1608X055N_0603]
R147  value 16.9k  Package: 0603  [RESC1608X055N_0603]  (hidden comment: 16.9k/1%)
R148  2.4k/1%  [RESC1608X055N_0603]
R149  1k/1%  [RESC1608X055N_0603]
R150  4k/1%  [RESC1608X055N_0603]
R151  1k/1%  [RESC1608X055N_0603]
R152  1.69k/1%  [RESC1608X055N_0603]
R153  1k/1%  [RESC1608X055N_0603]
U36  XL1509-5.0  [so-8]  (value not drawn)
U37  XL1509-5.0  [so-8]  (value not drawn)
U38  XL1509-5.0  [so-8]

### Nets
GND: C57.2 C59.1 C60.2 C61.2 C62.2 C63.2 C64.2 C65.2 C66.1 C67.2 D22.1(A) D24.1(A) D25.1(A) D26.1(A) P16.1 R147.1 R149.1 R151.1 R153.1 U36.4(ON/OFF) U36.5(GND) U36.6(GND) U36.7(GND) U36.8(GND) U37.4(ON/OFF) U37.5(GND) U37.6(GND) U37.7(GND) U37.8(GND) U38.4(ON/OFF) U38.5(GND) U38.6(GND) U38.7(GND) U38.8(GND)
V_Power: C59.2 C61.1 C65.1 C66.2 F1.2 U36.1(VIN) U37.1(VIN) U38.1(VIN)  [project net 24V_FO]
VCC_3.3V: C67.1 L3.1 R152.2
VCC_4G: C60.1 L1.1 R148.2
VCC_5V: C63.1 C64.1 L2.1 R150.2
VCC_IN: C58.1 P16.2 Q3.4(S) R146.1
NetC57_1: C57.1 D23.2(K) D24.2(A) F1.1 Q3.1(D) Q3.2(D) Q3.5(D) Q3.6(D)
NetC58_2: C58.2 D23.1(A) Q3.3(G) R147.2
NetC62_1: C62.1 R146.2
NetD22_2: D22.2(K) L1.2 U36.2(OUTPUT)
NetD25_2: D25.2(K) L2.2 U37.2(OUTPUT)
NetD26_2: D26.2(K) L3.2 U38.2(OUTPUT)
NetR148_1: R148.1 R149.2 U36.3(FEEDBACK)
NetR150_1: R150.1 R151.2 U37.3(FEEDBACK)
NetR152_1: R152.1 R153.2 U38.3(FEEDBACK)

### Notes on the sheet
- SQ3457, PMN50XP-VB
- trace width >30mil
- (in symbol SQ3419AEEV-T1_GE3) 1, 2, 5, 6

### Library data of the parts
C57 C58 C60-C62 C65 C67 = Cap Pol3: Polarized Capacitor (Surface Mount); Value: 100uF/50V
C59 C66 = Cap: Capacitor
C63 C64 = Capacitor_1206: PartNumber: GRM31CR61E476ME44L; Voltage Rating: [voltage]
  C63: Value: 0.1uF/35V
  C64: Value: 22uF/35V
D22 D25 D26 = FSV340AF: Schottky Barrier Rectifier, 40 V, 2-Pin SMA-FL, Pb-Free, Tape and Reel; PartNumber: B540C-13-F; Value: SS34
D23 = BZT52C12S-7-F: Zener Current: 5mA; Vz - Zener Voltage: 12V; Zz - Zener Impedance: 40Ohms; Voltage Temperature Coefficient: 0.25mV/C; Voltage Tolerance: 5%; Width: 1.4mm; Value: BZT52C12S-7-F; PartNumber: BZT52C12S
D24 = SMAJ12CA: Value: SMAJ33CA; PartNumber: SMAJ33CA
F1 = Fuse 1: PartNumber: BSMD1206-050-30V; Value: 30V/500mA
L1-L3 = BDCD002520122R2MS1: Value: FXL0650-470-M; PartNumber: BDCD002520122R2MS1
P16 = Header 2: Header, 2-Pin
Q3 = SQ3419AEEV-T1_GE3: PartNumber: PMN50XP-VB; Value: SQ3419AEEV-T1_GE3
R146 R148 = R: PartNumber: RC0603FR-071KL; Value: 1k/1%; Package: 0603
R147 = Resistor_0603: PartNumber: FRC0603F1692TS
R149-R153 = R: PartNumber: RC0603FR-071KL; Package: 0603
  R149 R151 R153: Value: 1k/1%
  R150: Value: 4k/1%
  R152: Value: 1.69k/1%

## Nets that join several sheets
24V_FO: DI (19 pins), power (8 pins)
GND: cpu (24 pins), DI (64 pins), lte (46 pins), power (34 pins)
VCC_3.3V: cpu (FB1.1 P2.1 R1.1), DI (40 pins), power (C67.1 L3.1 R152.2)
VCC_4G: lte (6 pins), power (C60.1 L1.1 R148.2)
VCC_5V: cpu (C2.2 U1.2), power (C63.1 C64.1 L2.1 R150.2)
CP: cpu (U2.37), DI (U26.2 U27.2 U30.2 U31.2)
lte_pwr_ctrl: cpu (U2.8), lte (R135.1)
MAIN_RXD: cpu (U2.59), lte (P9.2 U34.18)
MAIN_TXD: cpu (U2.42), lte (P9.3 U34.17)
PL: cpu (U2.38), DI (U26.1 U27.1 U30.1 U31.1)
USB_N: cpu (R157.1), lte (D20.2 J1.A7 J1.B7 R140.1)
USB_P: cpu (R156.1), lte (D21.2 J1.A6 J1.B6 R141.1)